# EAGLE design x-port-adapter (EAGLE 5.11)
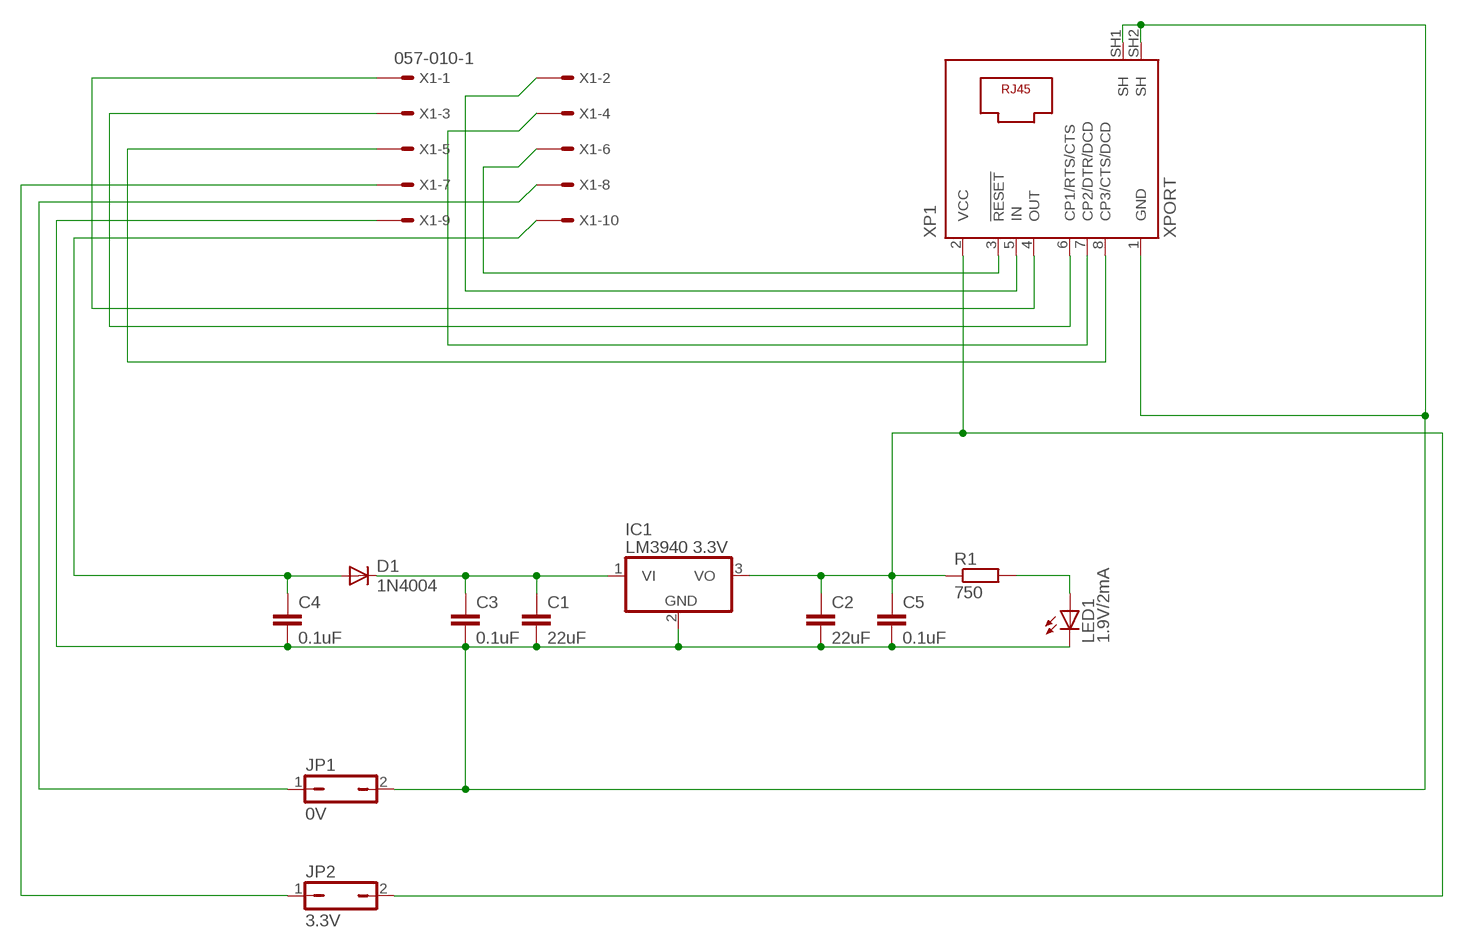
[diagram p0: schematic, sheet 1]

## Parts
C1  22uF  C27/13  [C27.5B13]
C2  22uF  C27/13  [C27.5B13]
C3  0.1uF  C7.5/3  [C7.5B3]
C4  0.1uF  C7.5/3  [C7.5B3]
C5  0.1uF  C7.5/3  [C7.5B3]
D1  1N4004  [DO41-10]
IC1  LM3940 3.3V  7805T  [TO220H]
JP1  0V  JP1Q  [JP1]
JP2  3.3V  JP1Q  [JP1]
LED1  1.9V/2mA  LED5MM  [LED5MM]
R1  750  R-EU_0207/15  [0207/15]
X1  057-010-1  [057-010-1]
XP1  XPORT  [XPORT]

## Nets
N$1: C4.1 D1.A X1.10
N$2: C1.1 C3.1 D1.C IC1.1(VI)
N$3: C1.2 C2.2 C3.2 C4.2 C5.2 IC1.2(GND) JP1.2 LED1.K(C) X1.9 XP1.1(GND) XP1.SH1(SH) XP1.SH2(SH)
N$4: LED1.A R1.2
N$5: X1.5 XP1.8(CP3/CTS/DCD)
N$6: JP2.1 X1.7
N$7: JP1.1 X1.8
N$8: X1.6 XP1.3(!RESET)
N$9: C2.1 C5.1 IC1.3(VO) JP2.2 R1.1 XP1.2(VCC)
N$10: X1.2 XP1.5(IN)
N$11: X1.4 XP1.7(CP2/DTR/DCD)
N$13: X1.1 XP1.4(OUT)
N$14: X1.3 XP1.6(CP1/RTS/CTS)

## Library data of the parts
C1-C5 = capacitor-wima:C: CAPACITOR naming: grid - package width
D1 = diode:1N4004: DIODE general purpose rectifier, 1 A
IC1 = linear:78*: Positive VOLTAGE REGULATOR Source: http://cache.national.com/ds/LM/LM78L05.pdf http://www.fairchildsemi.com/ds/LM/LM7805.pdf
JP1 JP2 = jumper:JP1Q: JUMPER
LED1 = led:LED: LED OSRAM: - CHIPLED LG R971, LG N971, LY N971, LG Q971, LY Q971, LO R971, LY R971 LH N974, LH R974 LS Q976, LO Q976, LY Q976 LO Q996 - Hyper CHIPLED LW Q18S LB Q993, LB Q99A, LB R99A - SideLED LS A670, LO A670, LY A670, LG A670, LP A670 LB A673, LV A673, LT A673, LW A673 LH A674 LY A675 LS A676, LA A676, LO A676, LY A676, LW A676 LS A679, LY A679, LG A679 - Hyper Micro SIDELED® LS Y876, LA Y876, LO Y876, LY Y876 LT Y87S - SmartLED LW L88C, LW L88S LB L89C, LB L89S, LG L890 LS L89K, LO L89K, LY L89K LS L896, LA L896, LO L896, LY L896 - TOPLED LS T670, LO T670, LY T670, LG T670, LP T670 LSG T670, LSP T670, LSY T670, LOP T670, LYG T670 LG T671, LOG T671, LSG T671 LB T673, LV T673, LT T673, LW T673 LH T674 LS T676, LA T676, LO T676, LY T676, LB T676, LH T676, LSB T676, LW T676 LB T67C, LV T67C, LT T67C, LS T67K, LO T67K, LY T67K, LW E67C LS E67B, LA E67B, LO E67B, LY E67B, LB E67C, LV E67C, LT E67C LW T67C LS T679, LY T679, LG T679 LS T770, LO T770, LY T770, LG T770, LP T770 LB T773, LV T773, LT T773, LW T773 LH T774 LS E675, LA E675, LY E675, LS T675 LS T776, LA T776, LO T776, LY T776, LB T776 LHGB T686 LT T68C, LB T68C - Hyper Mini TOPLED® LB M676 - Mini TOPLED Santana® LG M470 LS M47K, LO M47K, LY M47K Source: http://www.osram.convergy.de LUXEON: - LUMILED® LXK2-PW12-R00, LXK2-PW12-S00, LXK2-PW14-U00, LXK2-PW14-V00 LXK2-PM12-R00, LXK2-PM12-S00, LXK2-PM14-U00 LXK2-PE12-Q00, LXK2-PE12-R00, LXK2-PE12-S00, LXK2-PE14-T00, LXK2-PE14-U00 LXK2-PB12-K00, LXK2-PB12-L00, LXK2-PB12-M00, LXK2-PB14-N00, LXK2-PB14-P00, LXK2-PB14-Q00 LXK2-PR12-L00, LXK2-PR12-M00, LXK2-PR14-Q00, LXK2-PR14-R00 LXK2-PD12-Q00, LXK2-PD12-R00, LXK2-PD12-S00 LXK2-PH12-R00, LXK2-PH12-S00 LXK2-PL12-P00, LXK2-PL12-Q00, LXK2-PL12-R00 Source: www.luxeon.com KINGBRIGHT: KA-3528ASYC Source: www.kingbright.com
R1 = resistor:R-EU_: RESISTOR, European symbol
X1 = con-panduit:057-010-: CONNECTOR 10-pin series 057 contact pc board low profile headers; OC_FARNELL: unknown; OC_NEWARK: unknown
XP1 = lantronix:XPORT: Serial to 10/100 Ethernet transceiver Source: http://www.lantronix.com/pdf/XPort_DS.pdf; OC_FARNELL: unknown; OC_NEWARK: unknown

## Board
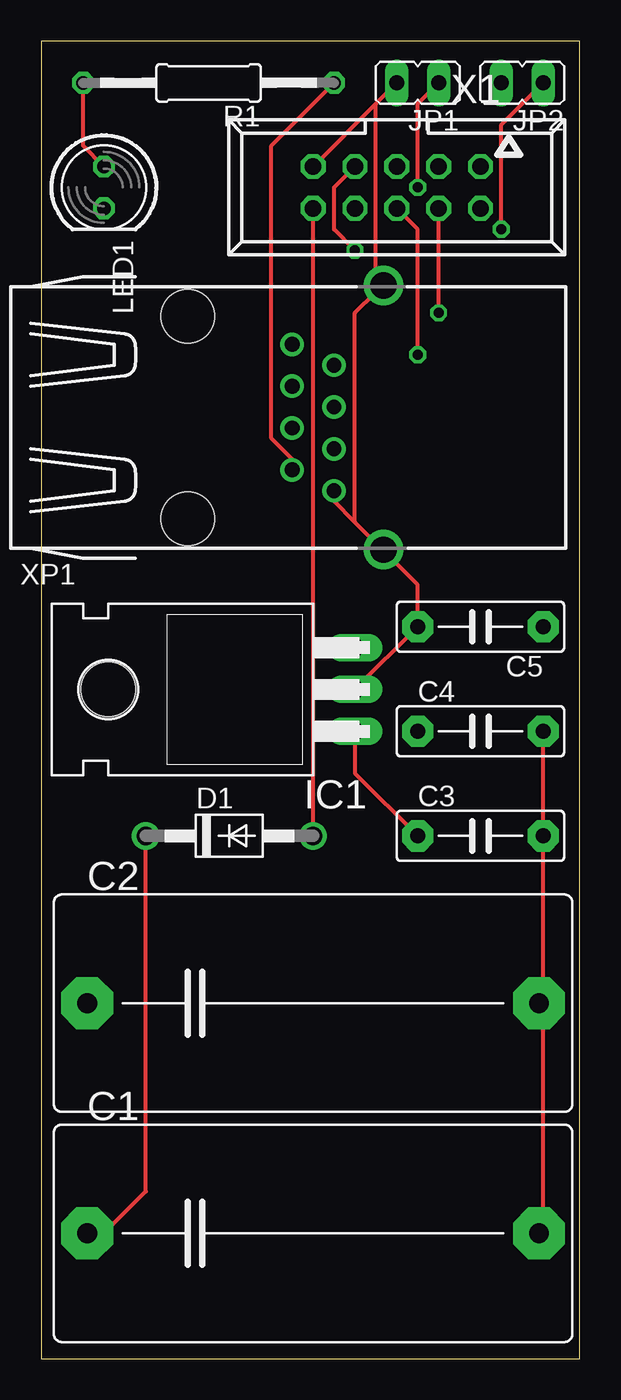
[diagram p1: board, top side]
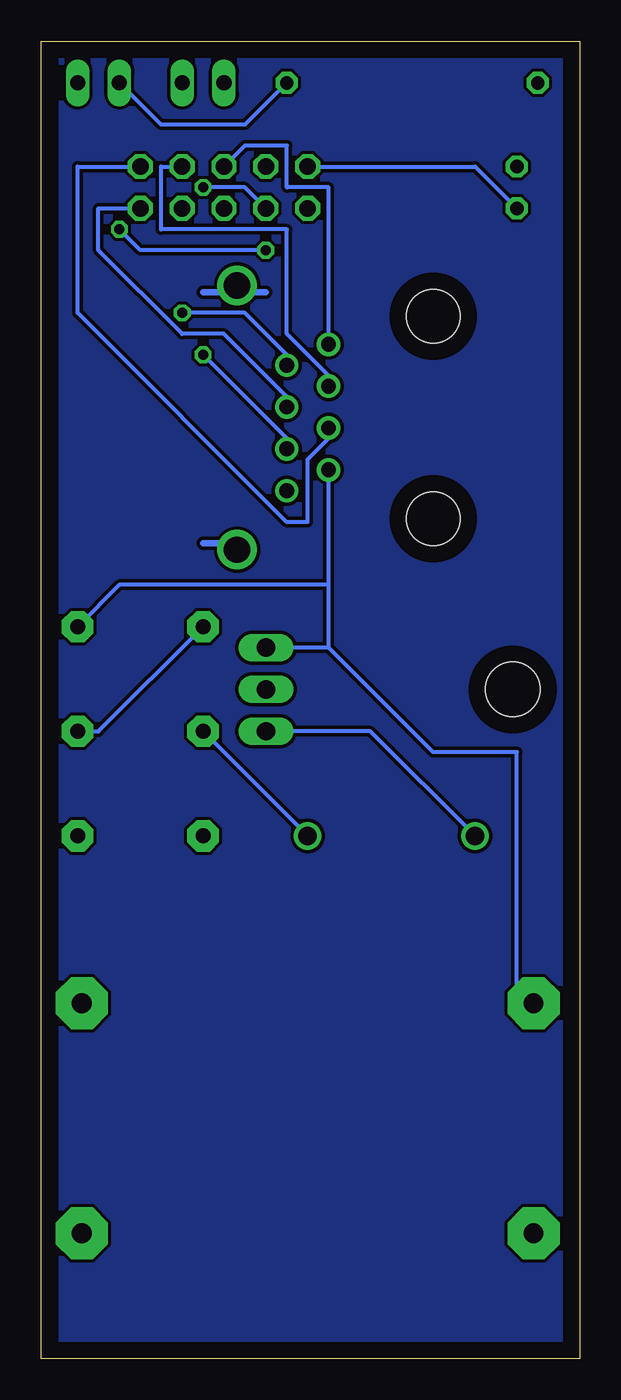
[diagram p2: board, bottom side, seen from below]

Size 32.69 x 80 mm. Coordinates in mm from the lower left corner, seen from the top.
Outline: 0,0 32.69,0 32.69,80 0,80 0,0
Copper layers (1*16): Top 0.035mm / dielectric 1.5mm / Bottom 0.035mm
Design rules "default": minimum track width 10mil, minimum drill 24mil, track to track 8mil, track to pad 8mil, pad to pad 8mil, via to via 8mil, smd to smd 8mil, copper to edge 40mil, drill to drill 8mil, minimum pad ring 10mil, minimum via ring 8mil, stop-mask expansion 4mil, vias tented up to drill 0mil, thermal gap 10mil

### Footprints (pad centres in the part's own frame; a part is rotated, then mirrored left to right if it is on the bottom)
C27.5B13 = drill 1.194 pad 3.15 octagon: 1 -13.716,0; 2 13.716,0
C7.5B3 = drill 0.914 pad 1.905 octagon: 1 -3.81,0; 2 3.81,0
DO41-10 = drill 1.118 round: A 5.08,0; C -5.08,0
TO220H = drill 1.118 long: 1 -2.54,-10.16; 2 0,-10.16; 3 2.54,-10.16 | hole 3.302: 0,4.826
JP1 = drill 0.914 long: 1 0,-1.27; 2 0,1.27
LED5MM = drill 0.813 octagon: A -1.27,0; K 1.27,0
0207/15 = drill 0.813 octagon: 1 -7.62,0; 2 7.62,0
057-010-1 = drill 1 octagon: 1 -5.08,-1.27; 2 -5.08,1.27; 3 -2.54,-1.27; 4 -2.54,1.27; 5 0,-1.27; 6 0,1.27; 7 2.54,-1.27; 8 2.54,1.27; 9 5.08,-1.27; 10 5.08,1.27
XPORT = drill 0.9 pad 1.422 round: 1 1.27,-4.445; 2 -1.27,-3.175; 3 1.27,-1.905; 4 -1.27,-0.635; 5 1.27,0.635; 6 -1.27,1.905; 7 1.27,3.175; 8 -1.27,4.445 | drill 1.6 pad 2.2 round: SH1 4.28,8.025; SH2 4.28,-8.025 | hole 3.25: -7.62,-6.15; -7.62,6.15

### Placement (x,y rotation side)
C1  16.51,7.62 0 top
C2  16.51,21.59 0 top
C3  26.67,31.75 0 top
C4  26.67,38.1 0 top
C5  26.67,44.45 180 top
D1  11.43,31.75 0 top
IC1  8.89,40.64 90 top
JP1  22.86,77.47 90 top
JP2  29.21,77.47 90 top
LED1  3.81,71.12 270 top
R1  10.16,77.47 180 top
X1  21.59,71.12 180 top
XP1  16.51,57.15 0 top

### Tracks (layer width: path | path; a pad name or v marks a point on that pad's centre or on a via)
N$1
  Top 0.254: D1.A X1.10
  Bottom 0.254: D1.A C4.1
N$2
  Top 0.254: C3.1 19.05,35.56 IC1.1 | D1.C 6.35,10.16 3.81,7.62 C1.1
  Bottom 0.254: D1.C 12.7,38.1 IC1.1
N$3
  Top 0.254: 20.32,76.2 X1.9 | 20.32,76.2 JP1.2 | 20.32,76.2 20.32,66.04 XP1.SH1 20.32,64.77 19.05,63.5 19.05,50.8 | 19.05,50.8 20.32,49.53 XP1.SH2 21.59,48.26 22.86,46.99 C5.2 IC1.2 | 19.05,50.8 17.78,52.07 XP1.1 | C4.2 C3.2 30.48,21.59 | 30.48,21.59 30.48,7.62 C1.2 | 30.48,21.59 C2.2
  Bottom 0.254: LED1.K 6.35,72.39 X1.9 | C5.2 29.21,38.1 C4.2
N$4
  Top 0.254: LED1.A 2.54,73.66 R1.2
N$5
  Bottom 0.254: X1.5 20.32,73.66 17.78,73.66 17.78,71.12 15.24,71.12 XP1.8
N$6  (via drill 0.61)
  Top 0.254: JP2.1 27.94,74.93 v27.94,68.58 | v19.05,67.31 17.78,68.58 17.78,71.12 X1.7
  Bottom 0.254: v27.94,68.58 26.67,67.31 v19.05,67.31
N$7  (via drill 0.61)
  Top 0.254: JP1.1 22.86,76.2 v22.86,71.12
  Bottom 0.254: v22.86,71.12 20.32,71.12 X1.8
N$8  (via drill 0.61)
  Top 0.254: v22.86,60.96 22.86,68.58 X1.6
  Bottom 0.254: v22.86,60.96 17.78,55.88 XP1.3
N$9
  Top 0.254: R1.1 13.97,73.66 13.97,55.88 15.24,54.61 XP1.2
  Bottom 0.254: R1.1 20.32,74.93 25.4,74.93 JP2.2 | 15.24,43.18 15.24,46.99 | 15.24,43.18 IC1.3 | 15.24,46.99 XP1.2 | C5.1 27.94,46.99 15.24,46.99 | 15.24,43.18 8.89,36.83 3.81,36.83 3.81,21.59 C2.1
N$10
  Bottom 0.254: X1.2 29.21,69.85 29.21,67.31 24.13,62.23 21.59,62.23 17.78,58.42 XP1.5
N$11  (via drill 0.61)
  Top 0.254: v24.13,63.5 X1.4
  Bottom 0.254: v24.13,63.5 20.32,63.5 17.78,60.96 XP1.7
N$12
  pour Bottom: 0,80.01 31.75,80.01 31.75,0 0,0
N$13
  Bottom 0.254: X1.1 30.48,72.39 30.48,63.5 17.78,50.8 16.51,50.8 16.51,54.61 15.24,55.88 XP1.4
N$14
  Bottom 0.254: X1.3 25.4,72.39 25.4,68.58 17.78,68.58 17.78,62.23 15.24,59.69 XP1.6
N$15
  Bottom 0.406: 21.59,49.53 22.86,49.53
N$16
  Bottom 0.406: 19.05,64.77 20.32,64.77
N$17
  Bottom 0.406: 21.59,64.77 22.86,64.77